# EAGLE schematic UBTB_MIX._spicesch (EAGLE 9.4.2)
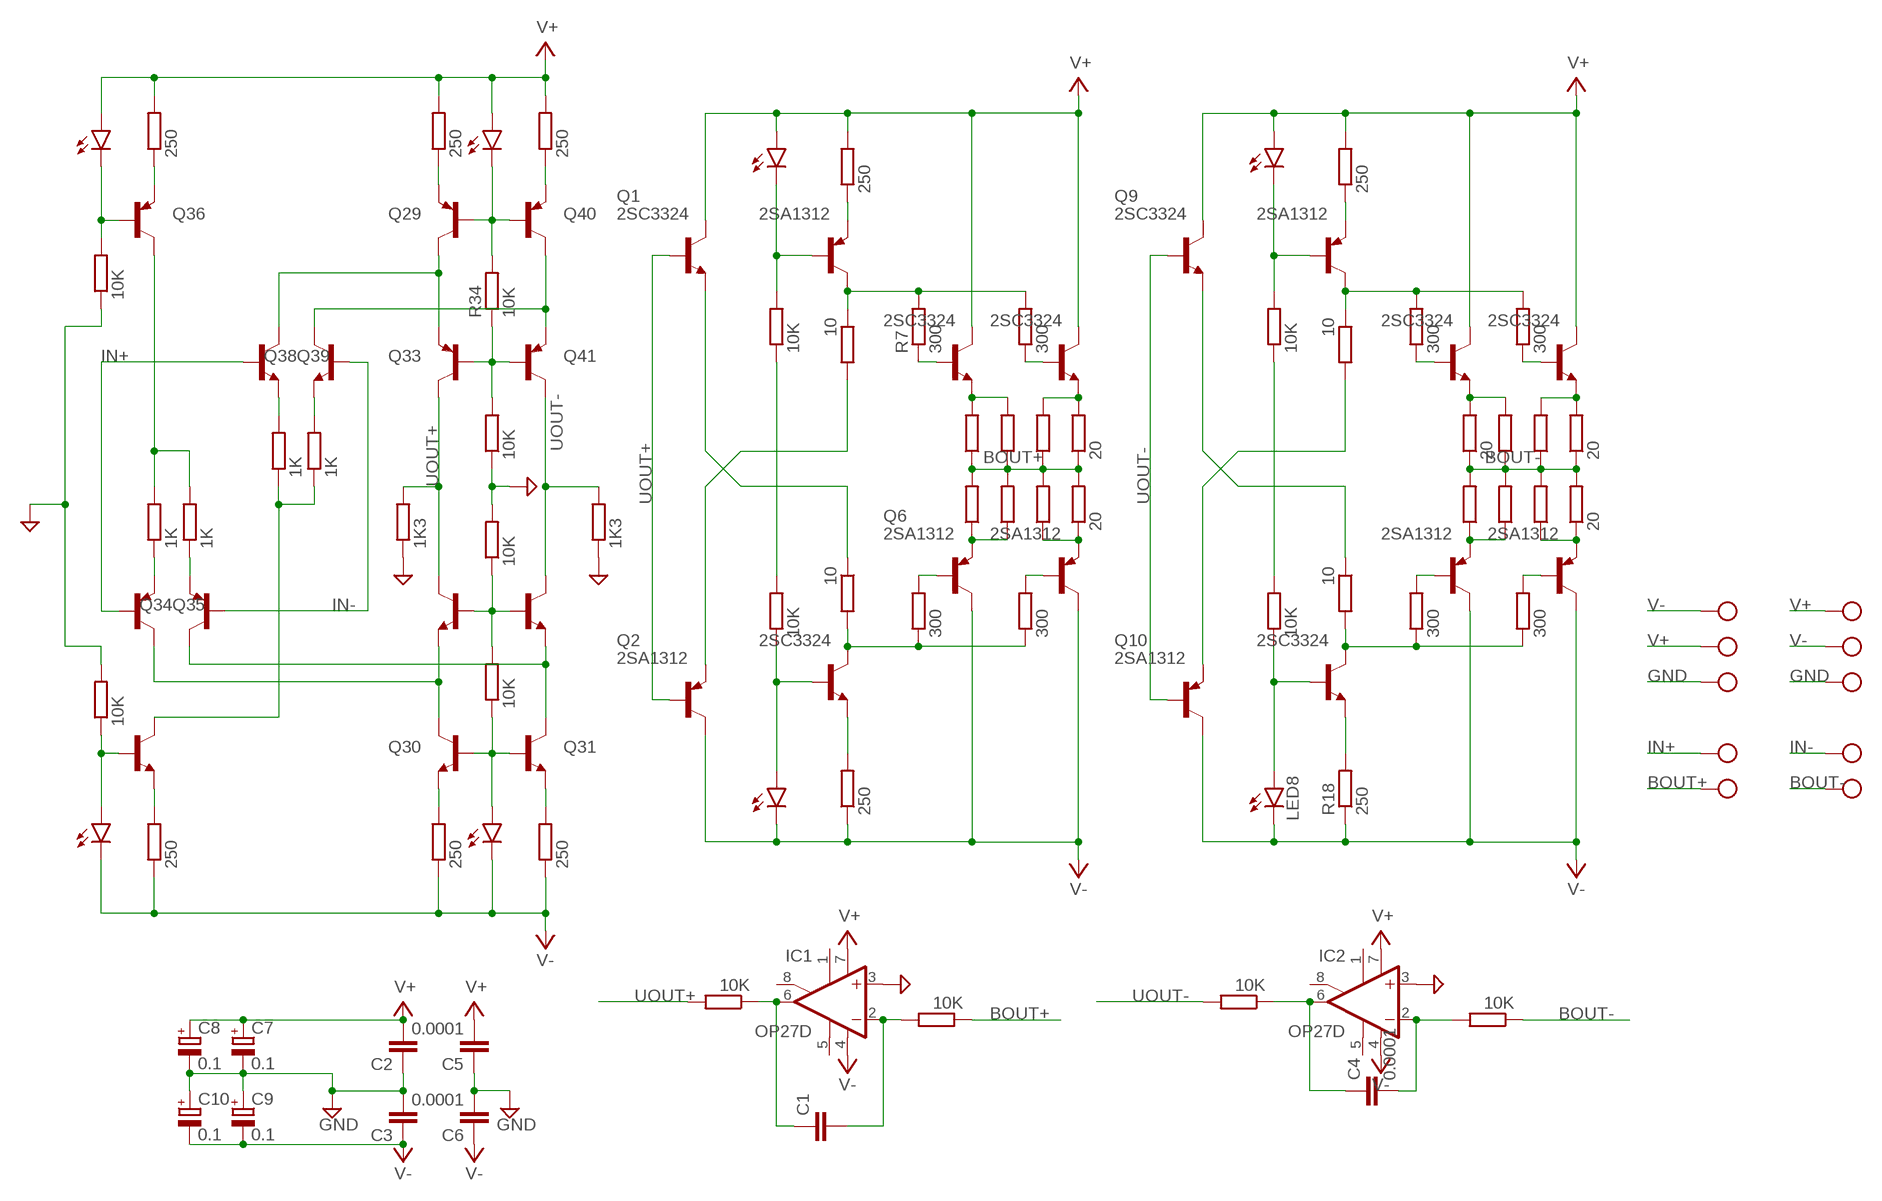
[diagram p0: schematic, sheet 1]

## Parts
C1  C-EUC1206  [C1206]
C2  C-EUC0805  [C0805]
C3  C-EUC0805  [C0805]
C4  0.0001  C-EUC1206  [C1206]
C5  0.0001  C-EUC0805  [C0805]
C6  0.0001  C-EUC0805  [C0805]
C7  0.1  CPOL-EUF  [PANASONIC_F]
C8  0.1  CPOL-EUF  [PANASONIC_F]
C9  0.1  CPOL-EUF  [PANASONIC_F]
C10  0.1  CPOL-EUF  [PANASONIC_F]
IC1  OP27D  [SO08]
IC2  OP27D  [SO08]
LED1  LEDCHIPLED_1206  [CHIPLED_1206]
LED2  LEDCHIPLED_1206  [CHIPLED_1206]
LED3  LEDCHIPLED_1206  [CHIPLED_1206]
LED4  LEDCHIPLED_1206  [CHIPLED_1206]
LED5  LEDCHIPLED_1206  [CHIPLED_1206]
LED6  LEDCHIPLED_1206  [CHIPLED_1206]
LED7  LEDCHIPLED_1206  [CHIPLED_1206]
LED8  LEDCHIPLED_1206  [CHIPLED_1206]
Q1  2SC3324  TRANSISTOR_BC846-NPN-SOT23-BEC  [TRANSISTOR_SOT23-BEC]
Q2  2SA1312  TRANSISTOR_BC856B-PNP-SOT23-BEC  [TRANSISTOR_SOT23-BEC]
Q3  2SC3324  TRANSISTOR_BC846-NPN-SOT23-BEC  [TRANSISTOR_SOT23-BEC]
Q4  2SA1312  TRANSISTOR_BC856B-PNP-SOT23-BEC  [TRANSISTOR_SOT23-BEC]
Q5  2SC3324  TRANSISTOR_BC846-NPN-SOT23-BEC  [TRANSISTOR_SOT23-BEC]
Q6  2SA1312  TRANSISTOR_BC856B-PNP-SOT23-BEC  [TRANSISTOR_SOT23-BEC]
Q7  2SA1312  TRANSISTOR_BC856B-PNP-SOT23-BEC  [TRANSISTOR_SOT23-BEC]
Q8  2SC3324  TRANSISTOR_BC846-NPN-SOT23-BEC  [TRANSISTOR_SOT23-BEC]
Q9  2SC3324  TRANSISTOR_BC846-NPN-SOT23-BEC  [TRANSISTOR_SOT23-BEC]
Q10  2SA1312  TRANSISTOR_BC856B-PNP-SOT23-BEC  [TRANSISTOR_SOT23-BEC]
Q11  2SC3324  TRANSISTOR_BC846-NPN-SOT23-BEC  [TRANSISTOR_SOT23-BEC]
Q12  2SA1312  TRANSISTOR_BC856B-PNP-SOT23-BEC  [TRANSISTOR_SOT23-BEC]
Q13  2SC3324  TRANSISTOR_BC846-NPN-SOT23-BEC  [TRANSISTOR_SOT23-BEC]
Q14  2SC3324  TRANSISTOR_BC846-NPN-SOT23-BEC  [TRANSISTOR_SOT23-BEC]
Q15  2SA1312  TRANSISTOR_BC856B-PNP-SOT23-BEC  [TRANSISTOR_SOT23-BEC]
Q16  2SA1312  TRANSISTOR_BC856B-PNP-SOT23-BEC  [TRANSISTOR_SOT23-BEC]
Q26  2SC3324  BC847CSMD  [SOT23]
Q29  2SA1312  BC857CSMD  [SOT23-BEC]
Q30  2SC3324  BC847CSMD  [SOT23]
Q31  2SC3324  BC847CSMD  [SOT23]
Q32  2SC3324  BC847CSMD  [SOT23]
Q33  2SA1312  BC857CSMD  [SOT23-BEC]
Q34  2SA1312  BC857CSMD  [SOT23-BEC]
Q35  2SA1312  BC857CSMD  [SOT23-BEC]
Q36  2SA1312  BC857CSMD  [SOT23-BEC]
Q37  2SC3324  BC847CSMD  [SOT23]
Q38  2SC3324  BC847CSMD  [SOT23]
Q39  2SC3324  BC847CSMD  [SOT23]
Q40  2SA1312  BC857CSMD  [SOT23-BEC]
Q41  2SA1312  BC857CSMD  [SOT23-BEC]
R1  250  R-EU_MELF0204W  [MINI_MELF-0204W]
R2  250  R-EU_MELF0204W  [MINI_MELF-0204W]
R3  10K  R-EU_MELF0204W  [MINI_MELF-0204W]
R4  10K  R-EU_MELF0204W  [MINI_MELF-0204W]
R5  10  R-EU_MELF0204W  [MINI_MELF-0204W]
R6  10  R-EU_MELF0204W  [MINI_MELF-0204W]
R7  300  R-EU_MELF0204W  [MINI_MELF-0204W]
R8  300  R-EU_MELF0204W  [MINI_MELF-0204W]
R9  300  R-EU_MELF0204W  [MINI_MELF-0204W]
R10  300  R-EU_MELF0204W  [MINI_MELF-0204W]
R11  R-EU_MELF0204W  [MINI_MELF-0204W]
R12  R-EU_MELF0204W  [MINI_MELF-0204W]
R13  20  R-EU_MELF0204W  [MINI_MELF-0204W]
R14  20  R-EU_MELF0204W  [MINI_MELF-0204W]
R15  250  R-EU_MELF0204W  [MINI_MELF-0204W]
R16  10K  R-EU_MELF0204W  [MINI_MELF-0204W]
R17  10K  R-EU_MELF0204W  [MINI_MELF-0204W]
R18  250  R-EU_MELF0204W  [MINI_MELF-0204W]
R19  10K  R-EU_MELF0204W  [MINI_MELF-0204W]
R20  10K  R-EU_MELF0204W  [MINI_MELF-0204W]
R21  10  R-EU_MELF0204W  [MINI_MELF-0204W]
R22  250  R-EU_MELF0204W  [MINI_MELF-0204W]
R23  250  R-EU_MELF0204W  [MINI_MELF-0204W]
R24  10  R-EU_MELF0204W  [MINI_MELF-0204W]
R25  300  R-EU_MELF0204W  [MINI_MELF-0204W]
R26  300  R-EU_MELF0204W  [MINI_MELF-0204W]
R27  300  R-EU_MELF0204W  [MINI_MELF-0204W]
R28  300  R-EU_MELF0204W  [MINI_MELF-0204W]
R29  10K  R-EU_MELF0204W  [MINI_MELF-0204W]
R30  20  R-EU_MELF0204W  [MINI_MELF-0204W]
R31  R-EU_MELF0204W  [MINI_MELF-0204W]
R32  10K  R-EU_MELF0204W  [MINI_MELF-0204W]
R33  10K  R-EU_MELF0204W  [MINI_MELF-0204W]
R34  10K  R-EU_MELF0204W  [MINI_MELF-0204W]
R35  250  R-EU_MELF0204W  [MINI_MELF-0204W]
R36  250  R-EU_MELF0204W  [MINI_MELF-0204W]
R37  1K3  R-EU_MELF0204W  [MINI_MELF-0204W]
R38  1K3  R-EU_MELF0204W  [MINI_MELF-0204W]
R39  1K  R-EU_MELF0204W  [MINI_MELF-0204W]
R40  1K  R-EU_MELF0204W  [MINI_MELF-0204W]
R41  1K  R-EU_MELF0204W  [MINI_MELF-0204W]
R42  1K  R-EU_MELF0204W  [MINI_MELF-0204W]
R43  250  R-EU_MELF0204W  [MINI_MELF-0204W]
R44  250  R-EU_MELF0204W  [MINI_MELF-0204W]
R45  10K  R-EU_MELF0204W  [MINI_MELF-0204W]
R46  10K  R-EU_MELF0204W  [MINI_MELF-0204W]
R47  20  R-EU_MELF0204W  [MINI_MELF-0204W]
R48  10K  R-EU_MELF0204W  [MINI_MELF-0204W]
R49  20  R-EU_MELF0204W  [MINI_MELF-0204W]
R50  R-EU_MELF0204W  [MINI_MELF-0204W]
R51  10K  R-EU_MELF0204W  [MINI_MELF-0204W]
R52  R-EU_MELF0204W  [MINI_MELF-0204W]
R53  R-EU_MELF0204W  [MINI_MELF-0204W]
R54  R-EU_MELF0204W  [MINI_MELF-0204W]
R55  R-EU_MELF0204W  [MINI_MELF-0204W]
R56  R-EU_MELF0204W  [MINI_MELF-0204W]
R57  R-EU_MELF0204W  [MINI_MELF-0204W]
R58  R-EU_MELF0204W  [MINI_MELF-0204W]
X1  CON-PHOENIX-508_MKDSN1,5/3-5,08  [CON-PHOENIX-508_MKDSN1,5/3-5,08]
X2  CON-PHOENIX-508_MKDSN1,5/3-5,08  [CON-PHOENIX-508_MKDSN1,5/3-5,08]
X3  CON-PHOENIX-508_MKDSN1,5/2-5,08  [CON-PHOENIX-508_MKDSN1,5/2-5,08]
X4  CON-PHOENIX-508_MKDSN1,5/2-5,08  [CON-PHOENIX-508_MKDSN1,5/2-5,08]

## Nets
BOUT+: R11.1 R12.2 R13.1 R14.2 R17.1 R50.1 R52.1 R53.2 R54.2 X3.2
BOUT-: R30.1 R31.2 R47.1 R48.1 R49.2 R55.1 R56.1 R57.2 R58.2 X4.2
GND: C2.1 C3.2 C5.1 C6.2 C7.- C8.- C9.+ C10.+ IC1.3(+IN) IC2.3(+IN) R32.2 R33.1 R37.1 R38.1 R45.1 R46.2 X1.3 X2.3
IN+: Q35.B Q39.1(B) X3.1
IN-: Q34.B Q38.1(B) X4.1
N$1: C4.1 IC2.6(OUT) R51.1
N$3: C4.2 IC2.2(-IN) R48.2
N$4: Q2.E R5.2
N$5: Q3.E R2.2
N$6: Q4.E R1.1
N$7: LED5.C Q4.B R3.2
N$8: LED6.A Q3.B R4.1
N$9: Q4.C R5.1 R7.2 R10.2
N$10: Q3.C R6.2 R8.1 R9.1
N$11: Q1.E R6.1
N$12: R3.1 R4.2
N$13: Q5.B R7.1
N$14: Q5.E R11.2 R50.2
N$15: Q7.B R9.2
N$16: Q8.B R10.1
N$17: Q6.B R8.2
N$18: Q6.E R12.1 R53.1
N$19: C1.2 IC1.2(-IN) R17.2
N$20: Q8.E R13.2 R52.2
N$21: Q7.E R14.1 R54.1
N$22: C1.1 IC1.6(OUT) R16.1
N$25: Q11.E R18.2
N$26: Q12.E R15.1
N$27: LED7.C Q12.B R19.2
N$28: LED8.A Q11.B R20.1
N$29: Q12.C R21.1 R25.2 R28.2
N$30: Q11.C R24.2 R26.1 R27.1
N$31: Q10.E R21.2
N$32: Q9.E R24.1
N$33: R19.1 R20.2
N$34: Q13.B R25.1
N$35: Q15.B R26.2
N$36: Q14.B R28.1
N$37: Q16.B R27.2
N$38: Q13.E R30.2 R55.2
N$39: Q15.E R31.1 R58.1
N$41: Q14.E R47.2 R56.2
N$42: Q16.E R49.1 R57.1
N$93: Q30.2(E) R22.2
N$94: Q31.2(E) R23.2
N$95: Q31.3(C) Q32.2(E) Q34.C
N$96: Q30.3(C) Q35.C Q37.2(E)
N$97: LED1.A Q30.1(B) Q31.1(B) R29.1
N$98: Q32.1(B) Q37.1(B) R29.2 R32.1
N$101: Q33.B Q41.B R33.2 R34.1
N$102: Q29.C Q33.E Q39.3(C)
N$103: LED2.C Q29.B Q40.B R34.2
N$104: Q38.3(C) Q40.C Q41.E
N$105: Q29.E R35.1
N$106: Q40.E R36.1
N$108: LED3.C Q36.B R45.2
N$109: Q36.E R43.1
N$110: Q36.C R41.2 R42.2
N$111: Q34.E R42.1
N$112: Q35.E R41.1
N$115: Q39.2(E) R39.2
N$116: Q38.2(E) R40.2
N$117: Q26.3(C) R39.1 R40.1
N$118: Q26.2(E) R44.2
N$119: LED4.A Q26.1(B) R46.1
UOUT+: Q1.B Q2.B Q33.C Q37.3(C) R16.2 R37.2
UOUT-: Q9.B Q10.B Q32.3(C) Q41.C R38.2 R51.2
V+: C2.2 C5.2 C7.+ C8.+ IC1.7(V+) IC2.7(V+) LED2.A LED3.A LED5.A LED7.A Q1.C Q5.C Q8.C Q9.C Q13.C Q14.C R1.2 R15.2 R35.2 R36.2 R43.2 X1.2 X2.1
V-: C3.1 C6.1 C9.- C10.- IC1.4(V-) IC2.4(V-) LED1.C LED4.C LED6.C LED8.C Q2.C Q6.C Q7.C Q10.C Q15.C Q16.C R2.1 R18.1 R22.1 R23.1 R44.1 X1.1 X2.2
Unconnected: IC1.1(ON1) IC1.5(OPT) IC1.8(ON2) IC2.1(ON1) IC2.5(OPT) IC2.8(ON2)

## Library data of the parts
C1-C6 = Vwvwbg:C-EU: CAPACITOR, European symbol; SPICEPREFIX: C
C7-C10 = Vwvwbg:CPOL-EU: POLARIZED CAPACITOR, European symbol; SPICEPREFIX: C
IC1 IC2 = linear:OP27: OP AMP
LED1 LED4 = led:LED: LED OSRAM: - CHIPLED LG R971, LG N971, LY N971, LG Q971, LY Q971, LO R971, LY R971 LH N974, LH R974 LS Q976, LO Q976, LY Q976 LO Q996 - Hyper CHIPLED LW Q18S LB Q993, LB Q99A, LB R99A - SideLED LS A670, LO A670, LY A670, LG A670, LP A670 LB A673, LV A673, LT A673, LW A673 LH A674 LY A675 LS A676, LA A676, LO A676, LY A676, LW A676 LS A679, LY A679, LG A679 - Hyper Micro SIDELED® LS Y876, LA Y876, LO Y876, LY Y876 LT Y87S - SmartLED LW L88C, LW L88S LB L89C, LB L89S, LG L890 LS L89K, LO L89K, LY L89K LS L896, LA L896, LO L896, LY L896 - TOPLED LS T670, LO T670, LY T670, LG T670, LP T670 LSG T670, LSP T670, LSY T670, LOP T670, LYG T670 LG T671, LOG T671, LSG T671 LB T673, LV T673, LT T673, LW T673 LH T674 LS T676, LA T676, LO T676, LY T676, LB T676, LH T676, LSB T676, LW T676 LB T67C, LV T67C, LT T67C, LS T67K, LO T67K, LY T67K, LW E67C LS E67B, LA E67B, LO E67B, LY E67B, LB E67C, LV E67C, LT E67C LW T67C LS T679, LY T679, LG T679 LS T770, LO T770, LY T770, LG T770, LP T770 LB T773, LV T773, LT T773, LW T773 LH T774 LS E675, LA E675, LY E675, LS T675 LS T776, LA T776, LO T776, LY T776, LB T776 LHGB T686 LT T68C, LB T68C - Hyper Mini TOPLED® LB M676 - Mini TOPLED Santana® LG M470 LS M47K, LO M47K, LY M47K Source: http://www.osram.convergy.de LUXEON: - LUMILED® LXK2-PW12-R00, LXK2-PW12-S00, LXK2-PW14-U00, LXK2-PW14-V00 LXK2-PM12-R00, LXK2-PM12-S00, LXK2-PM14-U00 LXK2-PE12-Q00, LXK2-PE12-R00, LXK2-PE12-S00, LXK2-PE14-T00, LXK2-PE14-U00 LXK2-PB12-K00, LXK2-PB12-L00, LXK2-PB12-M00, LXK2-PB14-N00, LXK2-PB14-P00, LXK2-PB14-Q00 LXK2-PR12-L00, LXK2-PR12-M00, LXK2-PR14-Q00, LXK2-PR14-R00 LXK2-PD12-Q00, LXK2-PD12-R00, LXK2-PD12-S00 LXK2-PH12-R00, LXK2-PH12-S00 LXK2-PL12-P00, LXK2-PL12-Q00, LXK2-PL12-R00 Source: www.luxeon.com KINGBRIGHT: KA-3528ASYC Source: www.kingbright.com; SPICEPREFIX: D
LED2 LED3 LED5-LED8 = led:LED: LED OSRAM: - CHIPLED LG R971, LG N971, LY N971, LG Q971, LY Q971, LO R971, LY R971 LH N974, LH R974 LS Q976, LO Q976, LY Q976 LO Q996 - Hyper CHIPLED LW Q18S LB Q993, LB Q99A, LB R99A - SideLED LS A670, LO A670, LY A670, LG A670, LP A670 LB A673, LV A673, LT A673, LW A673 LH A674 LY A675 LS A676, LA A676, LO A676, LY A676, LW A676 LS A679, LY A679, LG A679 - Hyper Micro SIDELED® LS Y876, LA Y876, LO Y876, LY Y876 LT Y87S - SmartLED LW L88C, LW L88S LB L89C, LB L89S, LG L890 LS L89K, LO L89K, LY L89K LS L896, LA L896, LO L896, LY L896 - TOPLED LS T670, LO T670, LY T670, LG T670, LP T670 LSG T670, LSP T670, LSY T670, LOP T670, LYG T670 LG T671, LOG T671, LSG T671 LB T673, LV T673, LT T673, LW T673 LH T674 LS T676, LA T676, LO T676, LY T676, LB T676, LH T676, LSB T676, LW T676 LB T67C, LV T67C, LT T67C, LS T67K, LO T67K, LY T67K, LW E67C LS E67B, LA E67B, LO E67B, LY E67B, LB E67C, LV E67C, LT E67C LW T67C LS T679, LY T679, LG T679 LS T770, LO T770, LY T770, LG T770, LP T770 LB T773, LV T773, LT T773, LW T773 LH T774 LS E675, LA E675, LY E675, LS T675 LS T776, LA T776, LO T776, LY T776, LB T776 LHGB T686 LT T68C, LB T68C - Hyper Mini TOPLED® LB M676 - Mini TOPLED Santana® LG M470 LS M47K, LO M47K, LY M47K Source: http://www.osram.convergy.de LUXEON: - LUMILED® LXK2-PW12-R00, LXK2-PW12-S00, LXK2-PW14-U00, LXK2-PW14-V00 LXK2-PM12-R00, LXK2-PM12-S00, LXK2-PM14-U00 LXK2-PE12-Q00, LXK2-PE12-R00, LXK2-PE12-S00, LXK2-PE14-T00, LXK2-PE14-U00 LXK2-PB12-K00, LXK2-PB12-L00, LXK2-PB12-M00, LXK2-PB14-N00, LXK2-PB14-P00, LXK2-PB14-Q00 LXK2-PR12-L00, LXK2-PR12-M00, LXK2-PR14-Q00, LXK2-PR14-R00 LXK2-PD12-Q00, LXK2-PD12-R00, LXK2-PD12-S00 LXK2-PH12-R00, LXK2-PH12-S00 LXK2-PL12-P00, LXK2-PL12-Q00, LXK2-PL12-R00 Source: www.luxeon.com KINGBRIGHT: KA-3528ASYC Source: www.kingbright.com; SPICEPREFIX: L
Q1 Q3 Q5 Q8 Q9 Q11 Q14 = Vwvwbg:TRANSISTOR_*-NPN-: NPN Transistror BF959 corrected 2008.03.06; SPICEPREFIX: Q
Q2 Q4 Q6 Q7 Q10 Q12 Q15 Q16 = Vwvwbg:TRANSISTOR_*-PNP-: PNP Transistror; SPICEPREFIX: Q
Q13 = Vwvwbg:TRANSISTOR_*-NPN-: NPN Transistror BF959 corrected 2008.03.06; SPICEPREFIX: U
Q26 Q30-Q32 Q37-Q39 = transistor-npn:BC847*: NPN Transistor; SPICEPREFIX: Q
Q29 Q33-Q36 Q40 Q41 = transistor-pnp:BC857*: PNP Transistror; SPICEPREFIX: Q
R1-R9 R11-R15 R17-R23 R26 R29-R31 R34-R47 R49-R58 = Vwvwbg:R-EU_: RESISTOR, European symbol; SPICEPREFIX: R
R10 R25 R27 R28 R32 R48 = Vwvwbg:R-EU_: RESISTOR, European symbol; SPICEPREFIX: V
R16 R24 R33 = Vwvwbg:R-EU_: RESISTOR, European symbol; SPICEPREFIX: W
X1 X2 = Vwvwbg:CON-PHOENIX-508_MKDSN1,5/3-5,08: MKDSN 1,5/ 3-5,08 Printklemme Nennstrom: 13,5 A Nennspannung: 250 V Rastermaß: 5,08 mm Polzahl: 3 Anschlussart: Schraubanschluss Montage: Löten Anschlussrichtung Leiter/Platine: 0 ° Artikelnummer: 1729131 Source: http://eshop.phoenixcontact.com .. 1729131.pdf; SPICEPREFIX: X
X3 X4 = Vwvwbg:CON-PHOENIX-508_MKDSN1,5/2-5,08: MKDSN 1,5/ 2-5,08 Printklemme Nennstrom: 13,5 A Nennspannung: 250 V Rastermaß: 5,08 mm Polzahl: 2 Anschlussart: Schraubanschluss Montage: Löten Anschlussrichtung Leiter/Platine: 0 ° Artikelnummer: 1729128 Source: http://eshop.phoenixcontact.com .. 1729128.pdf; SPICEPREFIX: X